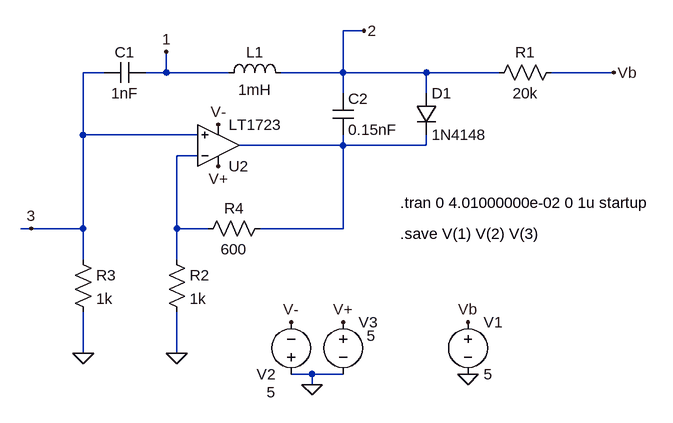
[diagram p0: schematic Vilnius.asc]
Vilnius.asc, the LTspice schematic file:
Version 4
SHEET 1 3852 1220
WIRE 480 -144 448 -144
WIRE 80 -80 48 -80
WIRE 176 -80 176 -112
WIRE 176 -80 144 -80
WIRE 272 -80 176 -80
WIRE 448 -80 448 -144
WIRE 448 -80 352 -80
WIRE 576 -80 448 -80
WIRE 688 -80 576 -80
WIRE 864 -80 768 -80
WIRE 448 -48 448 -80
WIRE 576 -48 576 -80
WIRE 48 16 48 -80
WIRE 224 16 48 16
WIRE 448 32 448 16
WIRE 448 32 288 32
WIRE 576 32 576 16
WIRE 576 32 448 32
WIRE 224 48 192 48
WIRE -32 160 -48 160
WIRE 48 160 48 16
WIRE 48 160 -32 160
WIRE 192 160 192 48
WIRE 240 160 192 160
WIRE 448 160 448 32
WIRE 448 160 320 160
WIRE 48 208 48 160
WIRE 192 208 192 160
WIRE 48 352 48 288
WIRE 192 352 192 288
WIRE 400 384 368 384
WIRE 448 384 400 384
WIRE 400 400 400 384
FLAG 48 352 0
FLAG 192 352 0
FLAG 864 -80 Vb
FLAG 176 -112 1
FLAG 480 -144 2
FLAG -32 160 3
FLAG 256 64 V+
FLAG 256 0 V-
FLAG 640 384 0
FLAG 640 304 Vb
FLAG 400 400 0
FLAG 448 304 V+
FLAG 368 304 V-
SYMBOL cap 80 -64 R270
WINDOW 0 32 32 VTop 2
WINDOW 3 0 32 VBottom 2
SYMATTR InstName C1
SYMATTR Value 1nF
SYMBOL ind 256 -64 R270
WINDOW 0 32 56 VTop 2
WINDOW 3 5 56 VBottom 2
SYMATTR InstName L1
SYMATTR Value 1mH
SYMBOL res 784 -96 R90
WINDOW 0 0 56 VBottom 2
WINDOW 3 32 56 VTop 2
SYMATTR InstName R1
SYMATTR Value 20k
SYMBOL cap 432 -48 R0
SYMATTR InstName C2
SYMATTR Value 0.15nF
SYMBOL diode 560 -48 R0
SYMATTR InstName D1
SYMATTR Value 1N4148
SYMBOL res 176 192 R0
SYMATTR InstName R2
SYMATTR Value 1k
SYMBOL res 32 192 R0
SYMATTR InstName R3
SYMATTR Value 1k
SYMBOL res 336 144 R90
WINDOW 0 0 56 VBottom 2
WINDOW 3 32 56 VTop 2
SYMATTR InstName R4
SYMATTR Value 600
SYMBOL voltage 640 288 R0
WINDOW 123 0 0 Left 0
WINDOW 39 0 0 Left 0
SYMATTR InstName V1
SYMATTR Value 5
SYMBOL voltage 448 288 R0
WINDOW 3 36 37 Left 2
WINDOW 123 0 0 Left 0
WINDOW 39 0 0 Left 0
SYMATTR Value 5
SYMATTR InstName V3
SYMBOL voltage 368 400 R180
WINDOW 3 24 -12 Left 2
WINDOW 123 0 0 Left 0
WINDOW 39 0 0 Left 0
SYMATTR Value 5
SYMATTR InstName V2
SYMBOL Opamps\\LT1723 256 96 M180
SYMATTR InstName U2
TEXT 536 120 Left 2 !.tran 0 4.01000000e-02 0 1u startup
TEXT 536 168 Left 2 !.save V(1) V(2) V(3)

The netlist it stands for:
* Vilnius.asc
C1 3 1 1nF
L1 1 2 1mH
R1 Vb 2 20k
C2 2 N001 0.15nF
D1 2 N001 1N4148
R2 N002 0 1k
R3 3 0 1k
R4 N001 N002 600
V1 Vb 0 5
V3 V+ 0 5
V2 0 V- 5
XU2 3 N002 V+ V- N001 LT1723  ; pins In+ In- V+ V- OUT
.model D D
.lib standard.dio
.tran 0 4.01000000e-02 0 1u startup
.save V(1) V(2) V(3)
.backanno
.end